# EAGLE design untitled2 (EAGLE 6.6.0)
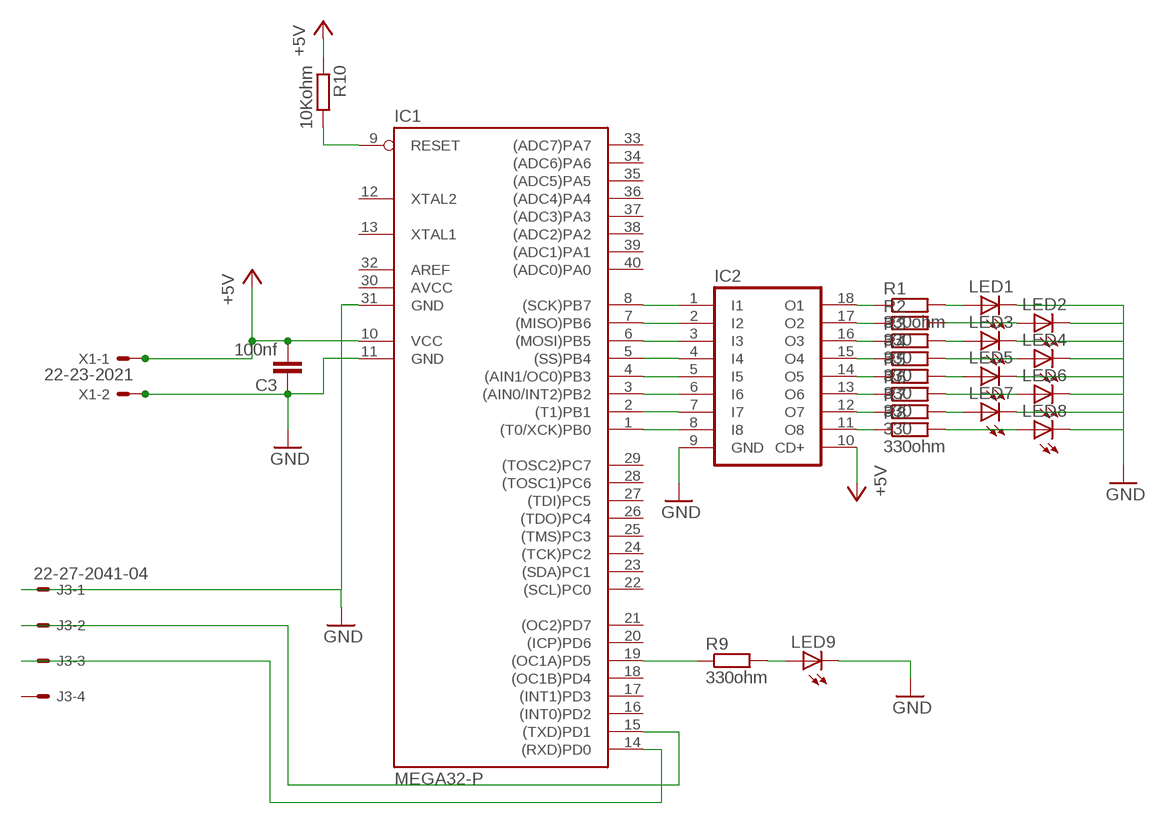
[diagram p0: schematic, sheet 1]

## Parts
C3  100nf  C-EU050-025X075  [C050-025X075]
IC1  MEGA32-P  [DIL40]
IC2  ULN2803A  [DIL18]
J3  22-27-2041-04  [6410-04]
LED1  LEDIRL80A  [IRL80A]
LED2  LEDIRL80A  [IRL80A]
LED3  LEDIRL80A  [IRL80A]
LED4  LEDIRL80A  [IRL80A]
LED5  LEDIRL80A  [IRL80A]
LED6  LEDIRL80A  [IRL80A]
LED7  LEDIRL80A  [IRL80A]
LED8  LEDIRL80A  [IRL80A]
LED9  LEDIRL80A  [IRL80A]
R1  330ohm  R-EU_0207/10  [0207/10]
R2  330  R-EU_0207/10  [0207/10]
R3  330  R-EU_0207/10  [0207/10]
R4  330  R-EU_0207/10  [0207/10]
R5  330  R-EU_0207/10  [0207/10]
R6  330  R-EU_0207/10  [0207/10]
R7  330  R-EU_0207/10  [0207/10]
R8  330ohm  R-EU_0207/10  [0207/10]
R9  330ohm  R-EU_0207/10  [0207/10]
R10  10Kohm  R-EU_0207/10  [0207/10]
X1  22-23-2021  [22-23-2021]

## Nets
N$1: IC1.8((SCK)PB7) IC2.1(I1)
N$2: IC1.7((MISO)PB6) IC2.2(I2)
N$3: IC1.6((MOSI)PB5) IC2.3(I3)
N$4: IC1.5((SS)PB4) IC2.4(I4)
N$5: IC1.4((AIN1/OC0)PB3) IC2.5(I5)
N$6: IC1.3((AIN0/INT2)PB2) IC2.6(I6)
N$7: IC1.2((T1)PB1) IC2.7(I7)
N$8: IC1.1((T0/XCK)PB0) IC2.8(I8)
N$9: LED1.A R1.2
N$10: LED2.A R2.2
N$11: LED3.A R3.2
N$12: LED4.A R4.2
N$13: LED5.A R5.2
N$14: LED6.A R6.2
N$15: LED7.A R7.2
N$16: LED8.A R8.2
N$17: IC1.19((OC1A)PD5) R9.1
N$18: LED9.A R9.2
N$19: IC1.9(RESET) R10.2
N$20: C3.2 IC1.10(VCC) IC2.10(CD+) R10.1 X1.1 ; supply symbol labelled +5V
N$21: C3.1 IC1.11(GND) IC1.31(GND) IC2.9(GND) J3.1 LED1.K(C) LED2.K(C) LED3.K(C) LED4.K(C) LED5.K(C) LED6.K(C) LED7.K(C) LED8.K(C) LED9.K(C) X1.2 ; supply symbol labelled GND
N$22: IC1.15((TXD)PD1) J3.2
N$24: IC1.14((RXD)PD0) J3.3
N$27: IC2.18(O1) R1.1
N$28: IC2.17(O2) R2.1
N$29: IC2.16(O3) R3.1
N$30: IC2.15(O4) R4.1
N$31: IC2.14(O5) R5.1
N$32: IC2.13(O6) R6.1
N$33: IC2.12(O7) R7.1
N$34: IC2.11(O8) R8.1
Unconnected: IC1.12(XTAL2) IC1.13(XTAL1) IC1.16((INT0)PD2) IC1.17((INT1)PD3) IC1.18((OC1B)PD4) IC1.20((ICP)PD6) IC1.21((OC2)PD7) IC1.22((SCL)PC0) IC1.23((SDA)PC1) IC1.24((TCK)PC2) IC1.25((TMS)PC3) IC1.26((TDO)PC4) IC1.27((TDI)PC5) IC1.28((TOSC1)PC6) IC1.29((TOSC2)PC7) IC1.32(AREF) IC1.33((ADC7)PA7) IC1.34((ADC6)PA6) IC1.35((ADC5)PA5) IC1.36((ADC4)PA4) IC1.37((ADC3)PA3) IC1.38((ADC2)PA2) IC1.39((ADC1)PA1) IC1.40((ADC0)PA0) J3.4

## Power pins joined to a net without a drawn wire
AVCC: IC1.30(AVCC)

## Library data of the parts
C3 = rcl:C-EU: CAPACITOR, European symbol
IC1 = atmel:MEGA32-P: MICROCONTROLLER 32 Kbytes FLASH 2 Kbytes SRAM 1 Kbytes EEPROM USART 8-channel 10 bit ADC Source: www.atmel.com .. doc2503.pdf; MPN: ATMEGA32-16PU; OC_FARNELL: 1661729; OC_NEWARK: 51P1794
IC2 = uln-udn:ULN2803A: DRIVER ARRAY
J3 = con-molex:22-?-04: CONNECTOR wire to board 2.54 mm (.1 inch) pitch header; OC_FARNELL: unknown; OC_NEWARK: unknown
LED1-LED9 = led:LED: LED OSRAM: - CHIPLED LG R971, LG N971, LY N971, LG Q971, LY Q971, LO R971, LY R971 LH N974, LH R974 LS Q976, LO Q976, LY Q976 LO Q996 - Hyper CHIPLED LW Q18S LB Q993, LB Q99A, LB R99A - SideLED LS A670, LO A670, LY A670, LG A670, LP A670 LB A673, LV A673, LT A673, LW A673 LH A674 LY A675 LS A676, LA A676, LO A676, LY A676, LW A676 LS A679, LY A679, LG A679 - Hyper Micro SIDELED® LS Y876, LA Y876, LO Y876, LY Y876 LT Y87S - SmartLED LW L88C, LW L88S LB L89C, LB L89S, LG L890 LS L89K, LO L89K, LY L89K LS L896, LA L896, LO L896, LY L896 - TOPLED LS T670, LO T670, LY T670, LG T670, LP T670 LSG T670, LSP T670, LSY T670, LOP T670, LYG T670 LG T671, LOG T671, LSG T671 LB T673, LV T673, LT T673, LW T673 LH T674 LS T676, LA T676, LO T676, LY T676, LB T676, LH T676, LSB T676, LW T676 LB T67C, LV T67C, LT T67C, LS T67K, LO T67K, LY T67K, LW E67C LS E67B, LA E67B, LO E67B, LY E67B, LB E67C, LV E67C, LT E67C LW T67C LS T679, LY T679, LG T679 LS T770, LO T770, LY T770, LG T770, LP T770 LB T773, LV T773, LT T773, LW T773 LH T774 LS E675, LA E675, LY E675, LS T675 LS T776, LA T776, LO T776, LY T776, LB T776 LHGB T686 LT T68C, LB T68C - Hyper Mini TOPLED® LB M676 - Mini TOPLED Santana® LG M470 LS M47K, LO M47K, LY M47K Source: http://www.osram.convergy.de LUXEON: - LUMILED® LXK2-PW12-R00, LXK2-PW12-S00, LXK2-PW14-U00, LXK2-PW14-V00 LXK2-PM12-R00, LXK2-PM12-S00, LXK2-PM14-U00 LXK2-PE12-Q00, LXK2-PE12-R00, LXK2-PE12-S00, LXK2-PE14-T00, LXK2-PE14-U00 LXK2-PB12-K00, LXK2-PB12-L00, LXK2-PB12-M00, LXK2-PB14-N00, LXK2-PB14-P00, LXK2-PB14-Q00 LXK2-PR12-L00, LXK2-PR12-M00, LXK2-PR14-Q00, LXK2-PR14-R00 LXK2-PD12-Q00, LXK2-PD12-R00, LXK2-PD12-S00 LXK2-PH12-R00, LXK2-PH12-S00 LXK2-PL12-P00, LXK2-PL12-Q00, LXK2-PL12-R00 Source: www.luxeon.com KINGBRIGHT: KA-3528ASYC Source: www.kingbright.com
R1-R10 = rcl:R-EU_: RESISTOR, European symbol
X1 = con-molex:22-23-2021: .100" (2.54mm) Center Header - 2 Pin; MF: MOLEX; MPN: 22-23-2021; OC_FARNELL: 1462926; OC_NEWARK: 25C3832

## Board
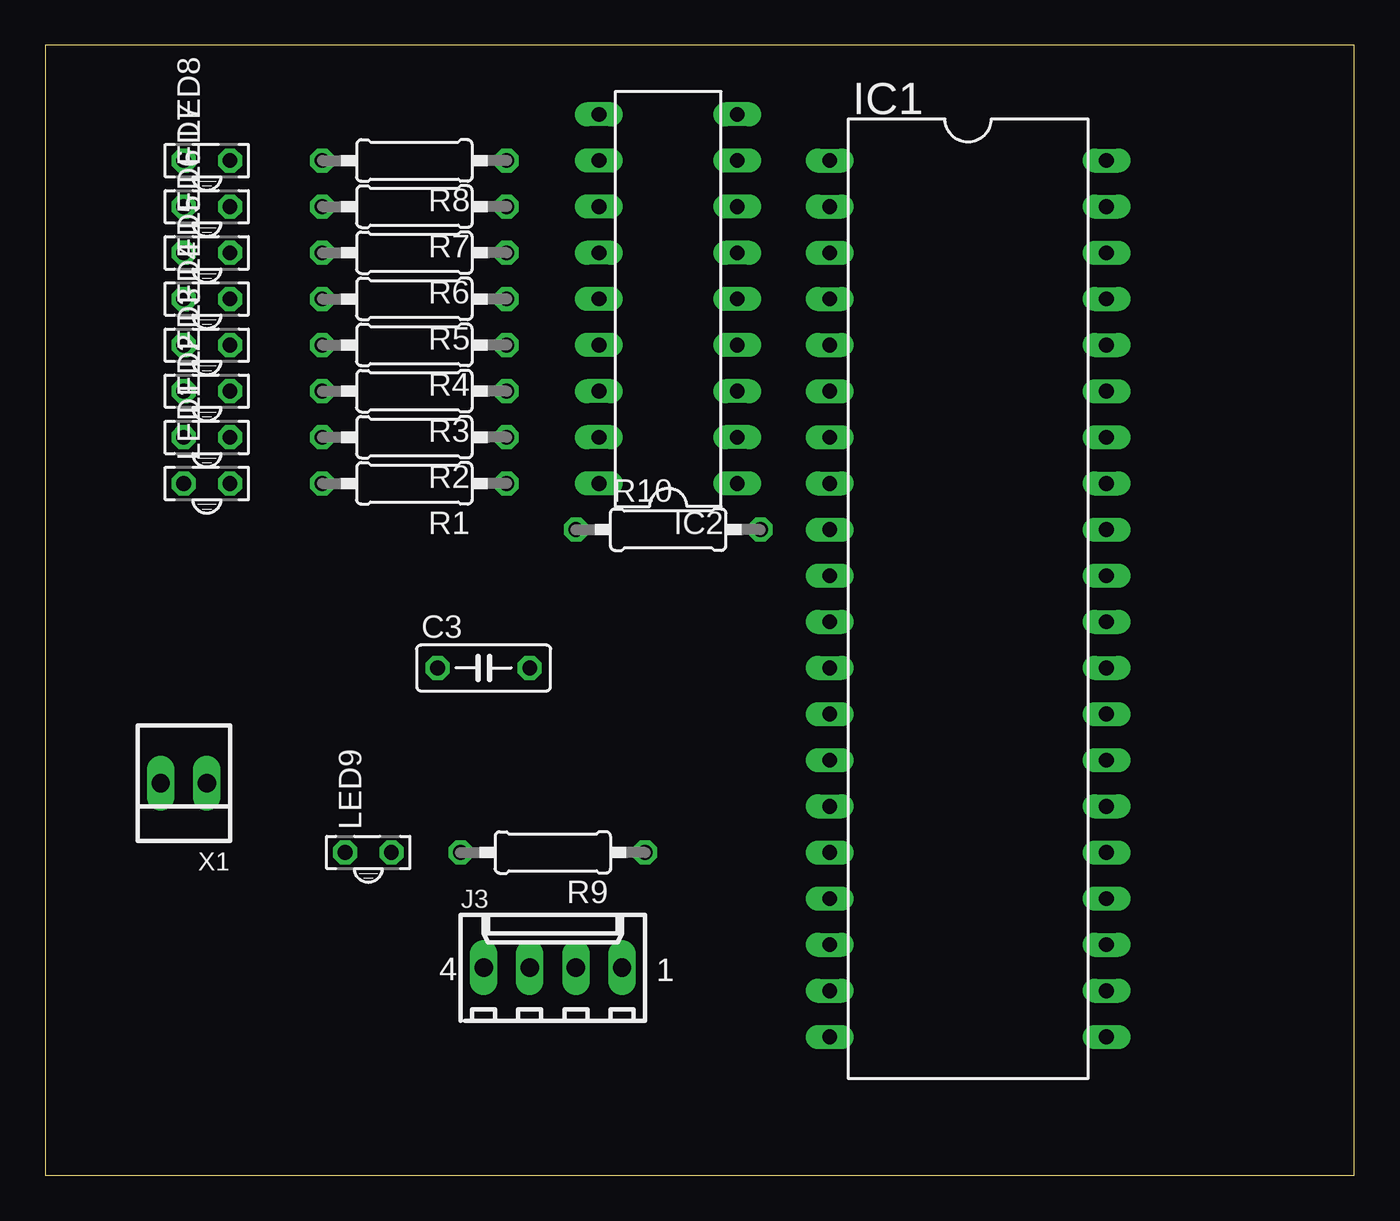
[diagram p1: board, top side]
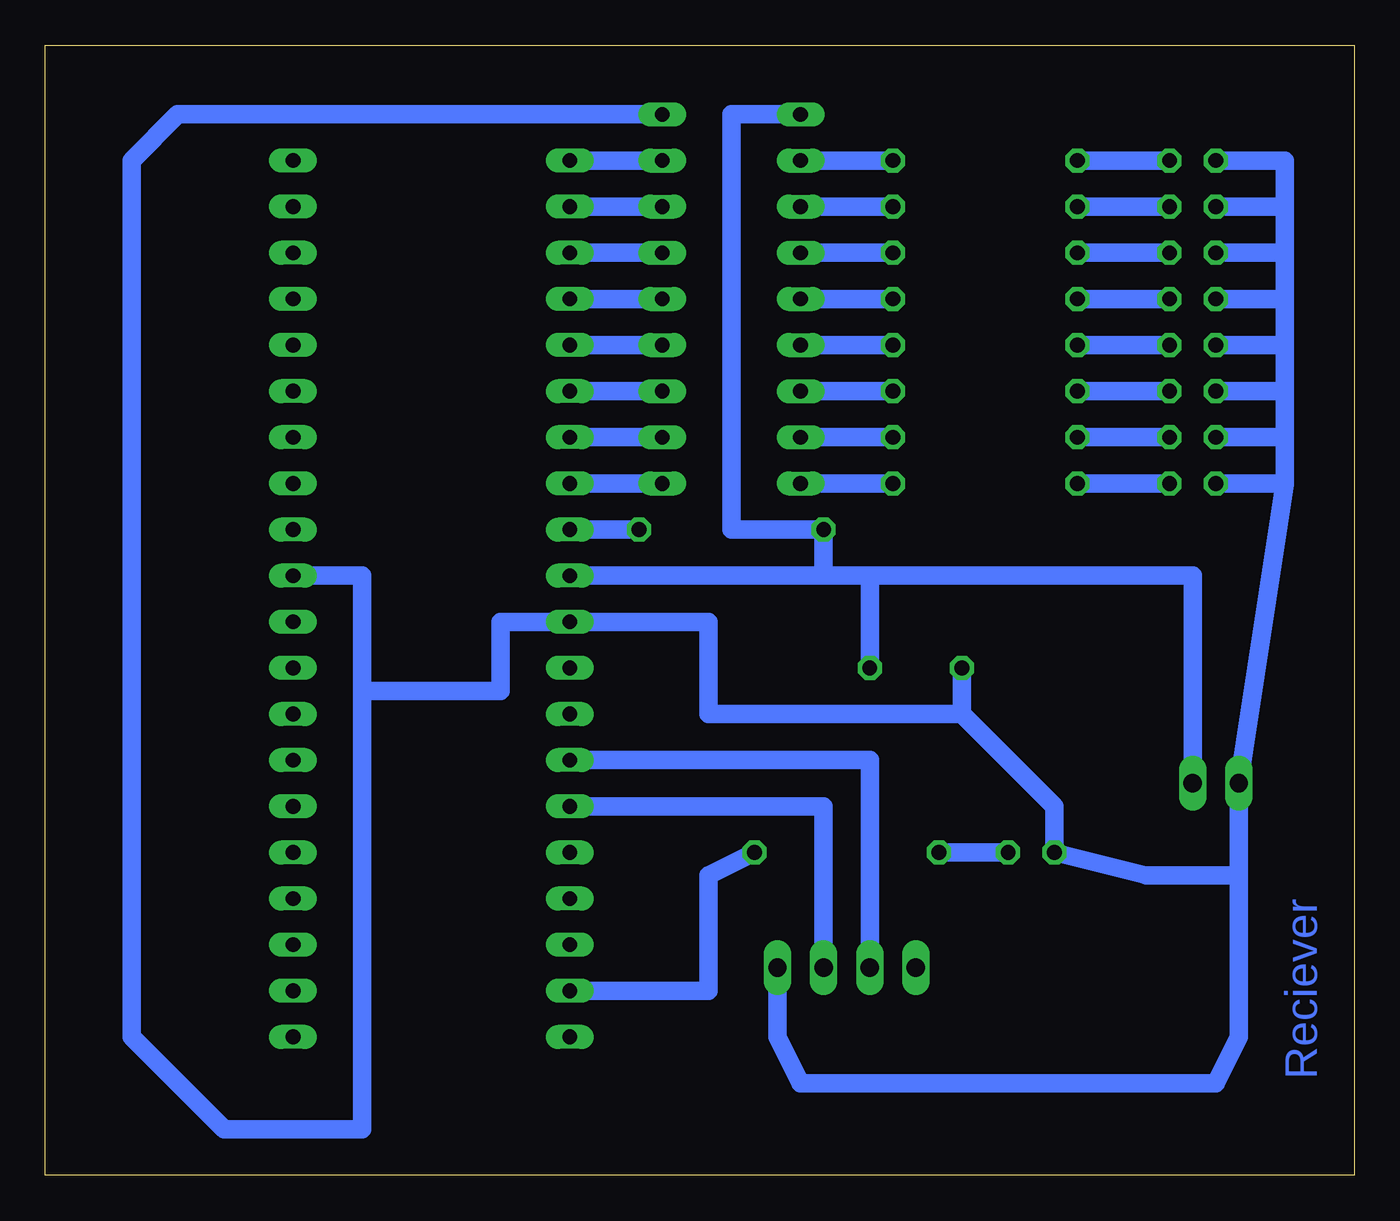
[diagram p2: board, bottom side, seen from below]

Size 72.06 x 62.22 mm. Coordinates in mm from the lower left corner, seen from the top.
Outline: 0,0 72.06,0 72.06,62.22 0,62.22 0,0
Copper layers (1*16): Top 0.035mm / dielectric 1.5mm / Bottom 0.035mm
Design rules "default": minimum track width 10mil, minimum drill 24mil, track to track 8mil, track to pad 8mil, pad to pad 8mil, via to via 8mil, smd to smd 8mil, copper to edge 40mil, drill to drill 8mil, minimum pad ring 10mil, minimum via ring 8mil, stop-mask expansion 4mil, vias tented up to drill 0mil, thermal gap 10mil

### Footprints (pad centres in the part's own frame; a part is rotated, then mirrored left to right if it is on the bottom)
C050-025X075 = drill 0.813 octagon: 1 -2.54,0; 2 2.54,0
DIL40 = drill 0.813 long: 1 -24.13,-7.62; 2 -21.59,-7.62; 3 -19.05,-7.62; 4 -16.51,-7.62; 5 -13.97,-7.62; 6 -11.43,-7.62; 7 -8.89,-7.62; 8 -6.35,-7.62; 9 -3.81,-7.62; 10 -1.27,-7.62; 11 1.27,-7.62; 12 3.81,-7.62; 13 6.35,-7.62; 14 8.89,-7.62; 15 11.43,-7.62; 16 13.97,-7.62; 17 16.51,-7.62; 18 19.05,-7.62; 19 21.59,-7.62; 20 24.13,-7.62; 21 24.13,7.62; 22 21.59,7.62; 23 19.05,7.62; 24 16.51,7.62; 25 13.97,7.62; 26 11.43,7.62; 27 8.89,7.62; 28 6.35,7.62; 29 3.81,7.62; 30 1.27,7.62; 31 -1.27,7.62; 32 -3.81,7.62; 33 -6.35,7.62; 34 -8.89,7.62; 35 -11.43,7.62; 36 -13.97,7.62; 37 -16.51,7.62; 38 -19.05,7.62; 39 -21.59,7.62; 40 -24.13,7.62
DIL18 = drill 0.813 long: 1 -10.16,-3.81; 2 -7.62,-3.81; 3 -5.08,-3.81; 4 -2.54,-3.81; 5 0,-3.81; 6 2.54,-3.81; 7 5.08,-3.81; 8 7.62,-3.81; 9 10.16,-3.81; 10 10.16,3.81; 11 7.62,3.81; 12 5.08,3.81; 13 2.54,3.81; 14 0,3.81; 15 -2.54,3.81; 16 -5.08,3.81; 17 -7.62,3.81; 18 -10.16,3.81
6410-04 = drill 1.016 long: 1 3.81,0; 2 1.27,0; 3 -1.27,0; 4 -3.81,0
IRL80A = drill 0.813 octagon: A 0,-1.27; K 0,1.27
0207/10 = drill 0.813 octagon: 1 -5.08,0; 2 5.08,0
22-23-2021 = drill 1 long: 1 -1.27,0; 2 1.27,0

### Placement (x,y rotation side)
C3  24.13,27.94 0 top
IC1  50.8,31.75 270 top
IC2  34.29,48.26 90 top
J3  27.94,11.43 0 top
LED1  8.89,38.1 90 top
LED2  8.89,40.64 90 top
LED3  8.89,43.18 90 top
LED4  8.89,45.72 90 top
LED5  8.89,48.26 90 top
LED6  8.89,50.8 90 top
LED7  8.89,53.34 90 top
LED8  8.89,55.88 90 top
LED9  17.78,17.78 90 top
R1  20.32,38.1 180 top
R2  20.32,40.64 180 top
R3  20.32,43.18 180 top
R4  20.32,45.72 180 top
R5  20.32,48.26 180 top
R6  20.32,50.8 180 top
R7  20.32,53.34 180 top
R8  20.32,55.88 180 top
R9  27.94,17.78 180 top
R10  34.29,35.56 0 top
X1  7.62,21.59 180 top

### Tracks (layer width: path | path; a pad name or v marks a point on that pad's centre or on a via)
N$1
  Bottom 1.016: IC2.1 IC1.8
N$2
  Bottom 1.016: IC2.2 IC1.7
N$3
  Bottom 1.016: IC2.3 IC1.6
N$4
  Bottom 1.016: IC2.4 IC1.5
N$5
  Bottom 1.016: IC2.5 IC1.4
N$6
  Bottom 1.016: IC2.6 IC1.3
N$7
  Bottom 1.016: IC1.2 IC2.7
N$8
  Bottom 1.016: IC2.8 IC1.1
N$9
  Bottom 1.016: R1.2 LED1.A
N$10
  Bottom 1.016: LED2.A R2.2
N$11
  Bottom 1.016: R3.2 LED3.A
N$12
  Bottom 1.016: LED4.A R4.2
N$13
  Bottom 1.016: R5.2 LED5.A
N$14
  Bottom 1.016: LED6.A R6.2
N$15
  Bottom 1.016: R7.2 LED7.A
N$16
  Bottom 1.016: LED8.A R8.2
N$17
  Bottom 1.016: R9.1 35.56,16.51 35.56,10.16 IC1.19
N$18
  Bottom 1.016: LED9.A R9.2
N$19
  Bottom 1.016: IC1.9 R10.2
N$20
  Bottom 1.016: IC2.10 34.29,58.42 34.29,35.56 R10.1 29.21,33.02 | IC1.10 29.21,33.02 | X1.1 8.89,33.02 26.67,33.02 | 26.67,33.02 C3.2 | 29.21,33.02 26.67,33.02
N$21
  Bottom 1.016: 54.61,26.67 46.99,26.67 46.99,30.48 IC1.11 35.56,30.48 35.56,25.4 21.59,25.4 | 54.61,26.67 54.61,33.02 IC1.31 | LED8.K 3.81,55.88 3.81,53.34 | 3.81,53.34 3.81,50.8 | 3.81,50.8 3.81,48.26 | 3.81,48.26 3.81,45.72 | 3.81,45.72 3.81,43.18 | 3.81,43.18 3.81,40.64 | 3.81,40.64 3.81,38.1 | LED2.K 3.81,40.64 | LED3.K 3.81,43.18 | LED4.K 3.81,45.72 | LED5.K 3.81,48.26 | LED6.K 3.81,50.8 | LED7.K 3.81,53.34 | LED1.K 3.81,38.1 | 3.81,38.1 X1.2 6.35,16.51 | C3.1 21.59,25.4 | 54.61,26.67 54.61,2.54 62.23,2.54 67.31,7.62 67.31,55.88 64.77,58.42 IC2.9 | J3.1 31.75,7.62 30.48,5.08 7.62,5.08 6.35,7.62 6.35,16.51 | 6.35,16.51 11.43,16.51 LED9.K 16.51,20.32 21.59,25.4
N$22
  Bottom 1.016: IC1.15 29.21,20.32 J3.2
N$24
  Bottom 1.016: IC1.14 26.67,22.86 J3.3
N$27
  Bottom 1.016: R1.1 IC2.18
N$28
  Bottom 1.016: IC2.17 R2.1
N$29
  Bottom 1.016: R3.1 IC2.16
N$30
  Bottom 1.016: IC2.15 R4.1
N$31
  Bottom 1.016: IC2.14 R5.1
N$32
  Bottom 1.016: R6.1 IC2.13
N$33
  Bottom 1.016: IC2.12 R7.1
N$34
  Bottom 1.016: R8.1 IC2.11

### Text on the board
Bottom: Reciever